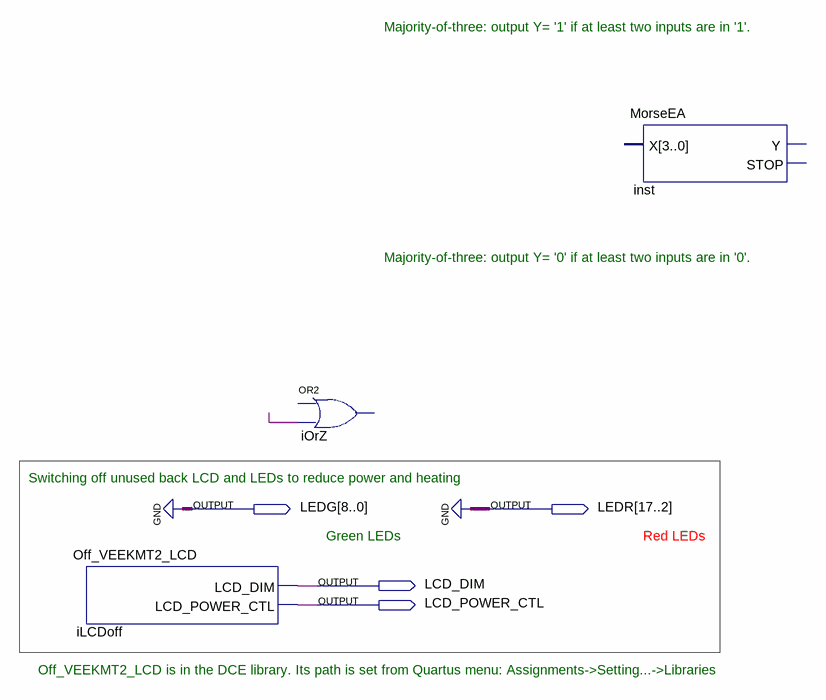
[diagram p0: schematic sheet]
// Quartus schematic ExampleMajority3.bdf as structural Verilog: 3 symbols, 4 pins
module ExampleMajority3 (
  output [8:0] LEDG,
  output [17:2] LEDR,
  output LCD_DIM,
  output LCD_POWER_CTL
);

  wire undriven;

  Off_VEEKMT2_LCD iLCDoff (.LCD_DIM(LCD_DIM), .LCD_POWER_CTL(LCD_POWER_CTL));
  // OR2 iOrZ has open pins: IN1=open, IN2=undriven, OUT=open
  MorseEA inst ();  // open: X, Y, STOP

  assign LEDG = {9{1'b0}};
  assign LEDR = {16{1'b0}};

  // Notes on the sheet:
  //   Majority-of-three: output Y= '1' if at least two inputs are in '1'.
  //   Majority-of-three: output Y= '0' if at least two inputs are in '0'.
  //   Switching off unused back LCD and LEDs to reduce power and heating
  //   Green LEDs
  //   Red LEDs
  //   Off_VEEKMT2_LCD is in the DCE library. Its path is set from Quartus menu: Assignments->Setting...->Libraries
endmodule
